# Altium project SwitchingRegulator.PrjPcb
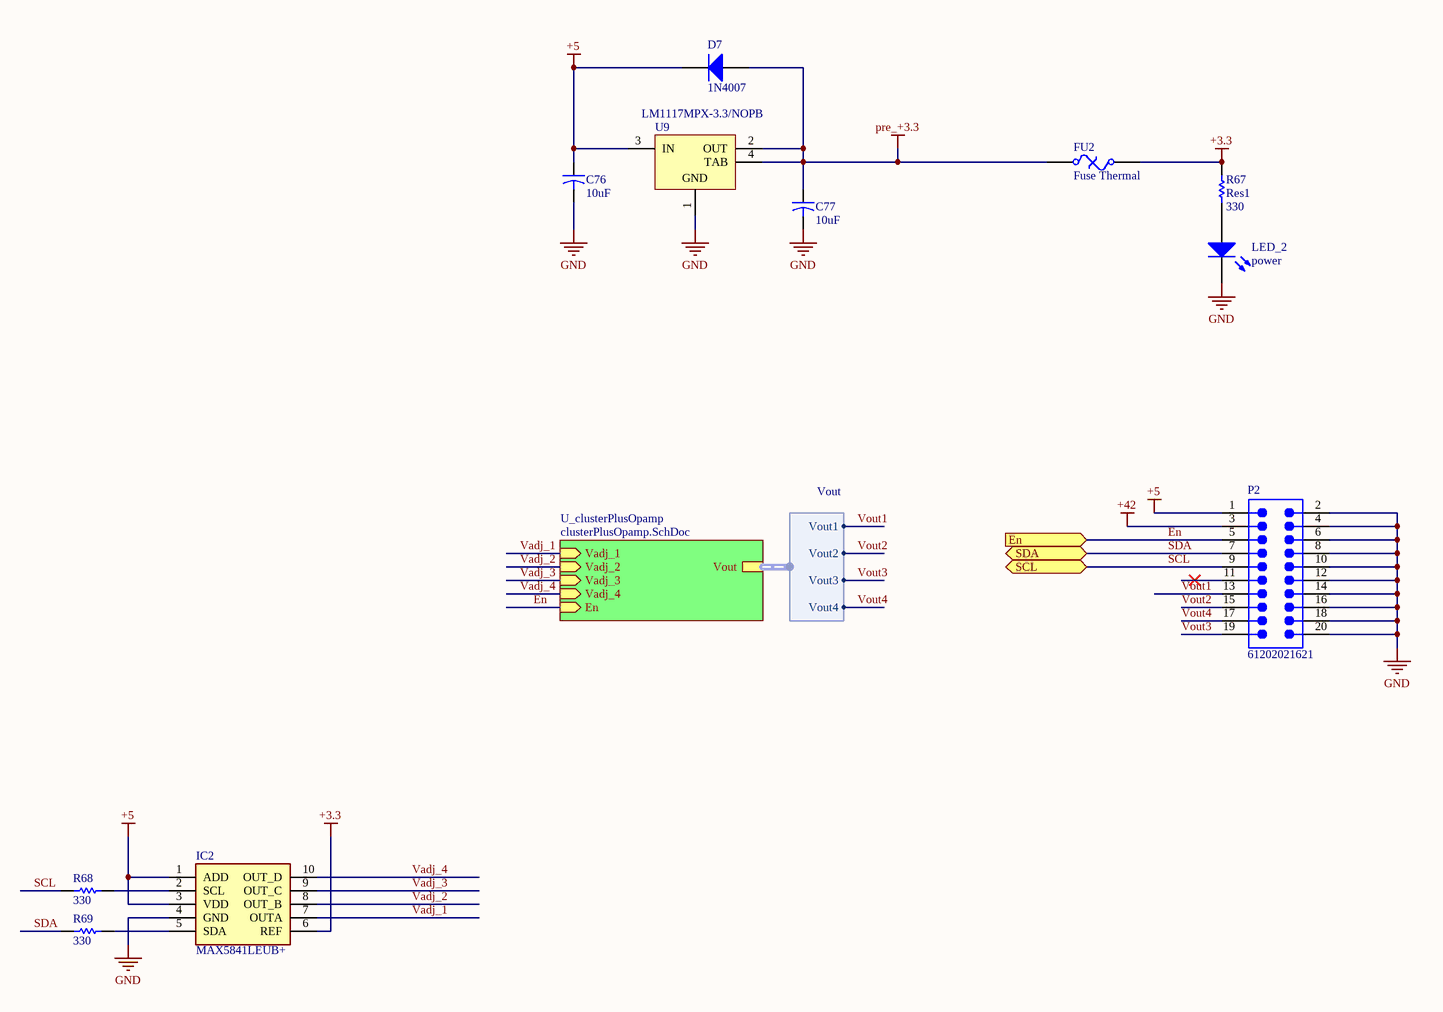
[diagram p0: AdjRegSection.SchDoc]
3 sheets, 134 parts. Net scope: hierarchical (ports join the sheet entries above them; power ports are global).
Board file: PCB1.PcbDoc
Sheets:
  AdjRegSection.SchDoc
    U_clusterPlusOpamp = clusterPlusOpamp.SchDoc
      SWReg1 = SWReg.SchDoc
      SWReg2 = SWReg.SchDoc
      SWReg3 = SWReg.SchDoc
      SWReg4 = SWReg.SchDoc

## Sheet AdjRegSection.SchDoc
size A3; SheetNumber: 1; SheetTotal: 3

### Parts
C76  value 10uF  [0805C]  (hidden comment: Cap_El)
C77  value 10uF  [0805C]  (hidden comment: Cap_El)
D7  1N4007  [430X270D]
FU2  Fuse Thermal  [1206]
IC2  MAX5841LEUB+  [SOP50P490X110-10N]
LED_2  power  [0805LED]
P2  61202021621  [61202021621]
R67  Res1  value 330  [0805L]
R68  330  [RESC3216X70X50NL05T20]
R69  330  [RESC3216X70X50NL05T20]
U9  LM1117MPX-3.3/NOPB  [DCY0004A_L]

### Sub-sheets
U_clusterPlusOpamp = clusterPlusOpamp.SchDoc: En (in), Vadj_1 (in), Vadj_2 (in), Vadj_3 (in), Vadj_4 (in), Vout (harness Vout)

### Ports
En (in), SCL (bidir), SDA (bidir)

### Harnesses
Vout: Vout1, Vout2, Vout3, Vout4

### Nets
+3.3: FU2.2 IC2.6(REF) R67.1
+5: C76.1 D7.2(K) IC2.1(ADD) IC2.3(VDD) P2.1 U9.3(IN)
+42: P2.3
GND: C76.2 C77.2 IC2.4(GND) LED_2.2(K) P2.2 P2.4 P2.6 P2.8 P2.10 P2.12 P2.14 P2.16 P2.18 P2.20 U9.1(GND)
pre_+3.3: C77.1 D7.1(A) FU2.1 U9.2(OUT) U9.4(TAB)
En: P2.5 ; port En, sheet U_clusterPlusOpamp/En
SCL: P2.9 R68.2 ; port SCL
SDA: P2.7 R69.2 ; port SDA
Vadj_1: IC2.7(OUTA) ; sheet U_clusterPlusOpamp/Vadj_1
Vadj_2: IC2.8(OUT_B) ; sheet U_clusterPlusOpamp/Vadj_2
Vadj_3: IC2.9(OUT_C) ; sheet U_clusterPlusOpamp/Vadj_3
Vadj_4: IC2.10(OUT_D) ; sheet U_clusterPlusOpamp/Vadj_4
Vout1: P2.13 ; sheet U_clusterPlusOpamp/Vout.Vout1
Vout2: P2.15 ; sheet U_clusterPlusOpamp/Vout.Vout2
Vout3: P2.19 ; sheet U_clusterPlusOpamp/Vout.Vout3
Vout4: P2.17 ; sheet U_clusterPlusOpamp/Vout.Vout4
NetIC2_2: IC2.2(SCL) R68.1
NetIC2_5: IC2.5(SDA) R69.1
NetLED_2_1: LED_2.1(A) R67.2

Not connected (* = marked no-connect by the designer): P2 11*

### Library data of the parts
C76 C77 = Cap_El: Capacitor; Published: 23-Sep-2002; PackageReference: CAPR5-4X5; Publisher: Altium Limited
D7 = Diode: 1 Amp General Purpose Rectifier; Revision 1: 11-Jul-2000: SIM Model Added.; Revision 2: 17-Jul-2002: Re-released for DXP Platform.; Package Information: Latest Revision: Aug-1999; Code - JEDEC: DO-204-AL; Published: 8-Jun-2000; Datasheet: Latest Revision: 1998; Package Reference: DO-41; Publisher: Altium Limited
FU2 = Fuse Thermal: Thermal Fuse; Published: 24-Mar-1999; LatestRevisionDate: 17-Jul-2002; LatestRevisionNote: Re-released for DXP Platform.; PackageReference: PIN-W2/E2.8; Publisher: Altium Limited; PackageDescription: Thru-Hole; 2 Leads
IC2 = MAX5841LEUB+: Integrated Circuit; Manufacturer_Name: Analog Devices; Datasheet Link: https://datasheets.maximintegrated.com/en/ds/MAX5841.pdf; Height: 1.1mm; Manufacturer_Part_Number: MAX5841LEUB+; Mouser Part Number: 700-MAX5841LEUB; Mouser Price/Stock: https://www.mouser.co.uk/ProductDetail/Maxim-Integrated/MAX5841LEUB%2b?qs=9Cj2FLRihcMjPr0cjsKN4w%3D%3D
LED_2 = LED3: Typical BLUE SiC LED; Published: 8-Jun-2000; LatestRevisionDate: 17-Dec-2003; LatestRevisionNote: PCB Footprint replaced.; DatasheetDocument: 16-Apr-2002; PackageDocument: 16-Apr-2002; PackageReference: 3.5X2.8X1.9; Publisher: Altium Limited
P2 = CMP-1502-00010-2: NexarPartId: 8917785; Number of Positions: 20; Row Spacing: 2.54mm; Voltage Rating (DC): 250V; Gender: Male; Insulation Resistance: 1GΩ; Current Rating: 3A; Connector Type: Male Pin; Contact Resistance: 20mΩ; Insulation: Insulated; Contact Material: Copper; REACH SVHC: Unknown; Width: 33.06mm; Pitch: 2.54mm; Housing Material: PBT; Number of Contacts: 20; Contact Plating: Gold; Mount: Through Hole; Termination: Through Hole; Number of Pins: 20; Color: Black; Max Operating Temperature: 105°C; Contact Gender: Male; Voltage Rating: 250V; Lead Pitch: 2.54mm; Operating Supply Voltage: 250V; Length: 33.06mm; Orientation: Vertical; Number of Rows: 2; Flammability Rating: UL94 V-0; RoHS: Compliant; Insulation Material: PBT; Min Operating Temperature: -40°C; Height: 8.85mm
R67 = Res1: Resistor; Published: 8-Jun-2000; LatestRevisionDate: 17-Jul-2002; LatestRevisionNote: Re-released for DXP Platform.; PackageReference: AXIAL-0.3; Publisher: Altium Limited
R68 R69 = CMP-2003-00782-1: Part Number: ERJ8BWFR068V; Manufacturer: Panasonic
U9 = CMP-0062-01639-4: 800mA Low-Dropout Linear Regulator, 4-pin SOT-223, Pb-Free; Manufacturer: Texas Instruments; High-Reliability: Y; PowerWise: N; PackageTopMarking: XYTT*N05A; CompType: LDO IC; ComponentLink1URL: http://www.ti.com/general/docs/lit/getliterature.tsp?genericPartNumber=LM1117-N&fileType=pdf; PartNumber: LM1117MPX-3.3/NOPB; ComponentLink1Description: Datasheet URL; PinCount: 4; Code_JEDEC: TO-261-AA; PackageDescription: Molded SOT-223, 6.50 x 3.56 x 1.6mm Body, 4 Lead, 2.3mm Pitch; PackageReference: DCY0004A; RoHS: Y; Code_IPC: SOT223-4

## Sheet clusterPlusOpamp.SchDoc
size A3; SheetNumber: 3; SheetTotal: 4
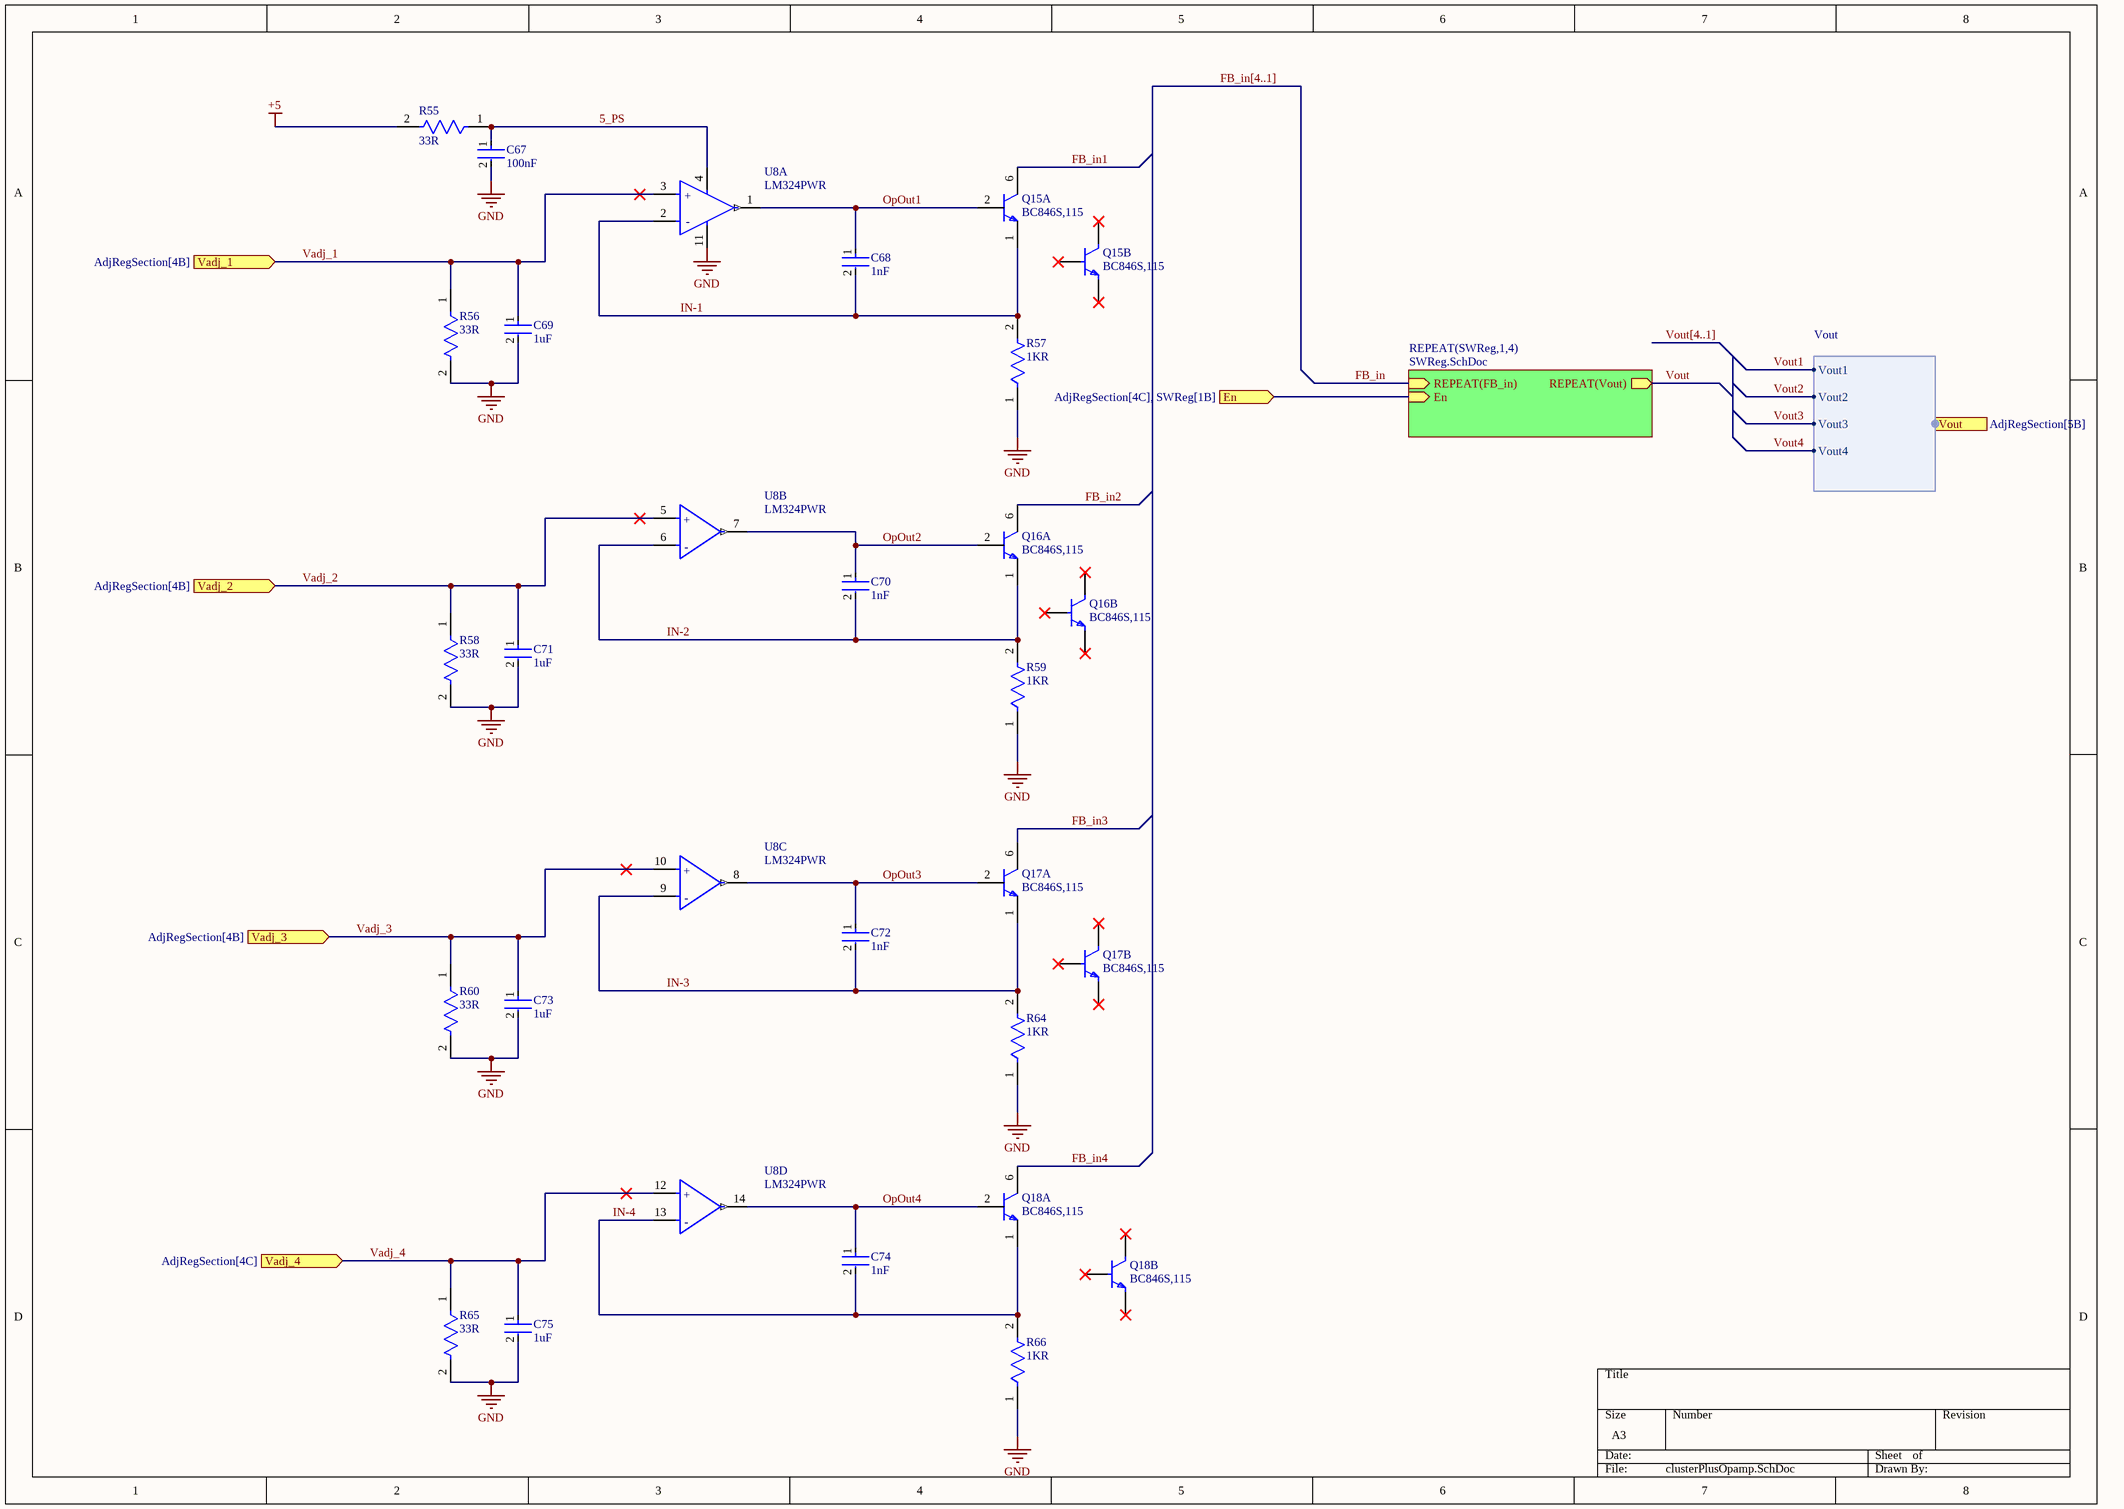
[diagram p1: clusterPlusOpamp.SchDoc]

### Parts
C67  100nF  [FP-CC1206-1_25-MFG]
C68  1nF  [FP-CC1206-1_25-MFG]
C69  1uF  [FP-CC1206-1_25-MFG]
C70  1nF  [FP-CC1206-1_25-MFG]
C71  1uF  [FP-CC1206-1_25-MFG]
C72  1nF  [FP-CC1206-1_25-MFG]
C73  1uF  [FP-CC1206-1_25-MFG]
C74  1nF  [FP-CC1206-1_25-MFG]
C75  1uF  [FP-CC1206-1_25-MFG]
Q15  BC846S,115  [FP-SOT363-MFG]  (parts A,B of 2)
Q16  BC846S,115  [FP-SOT363-MFG]  (parts A,B of 2)
Q17  BC846S,115  [FP-SOT363-MFG]  (parts A,B of 2)
Q18  BC846S,115  [FP-SOT363-MFG]  (parts A,B of 2)
R55  33R  [FP-RC0603-0_55-MFG]
R56  33R  [FP-RC0603-0_55-MFG]
R57  1KR  [FP-RC0603-0_55-MFG]
R58  33R  [FP-RC0603-0_55-MFG]
R59  1KR  [FP-RC0603-0_55-MFG]
R60  33R  [FP-RC0603-0_55-MFG]
R64  1KR  [FP-RC0603-0_55-MFG]
R65  33R  [FP-RC0603-0_55-MFG]
R66  1KR  [FP-RC0603-0_55-MFG]
U8  LM324PWR  [FP-PW0014A-MFG]  (parts A,B,C,D of 4)

### Sub-sheets
REPEAT(SWReg,1,4) = SWReg.SchDoc: REPEAT(Vout) (out), REPEAT(FB_in) (in), En (in)

### Ports
En (in, see AdjRegSection[4C], SWReg[1B]), Vadj_1 (in, see AdjRegSection[4B]), Vadj_2 (in, see AdjRegSection[4B]), Vadj_3 (in, see AdjRegSection[4B]), Vadj_4 (in, see AdjRegSection[4C]), Vout (harness Vout, see AdjRegSection[5B])

### Harnesses
Vout: Vout1, Vout2, Vout3, Vout4

### Nets
+5: R55.2
GND: C67.2 C69.2 C71.2 C73.2 C75.2 R56.2 R57.1 R58.2 R59.1 R60.2 R64.1 R65.2 R66.1 U8.11(GND)
5_PS: C67.1 R55.1 U8.4(VCC)
En: port En, sheet REPEAT(SWReg,1,4)/En
FB_in: sheet REPEAT(SWReg,1,4)/REPEAT(FB_in)
FB_in1: Q15.6(C)
FB_in2: Q16.6(C)
FB_in3: Q17.6(C)
FB_in4: Q18.6(C)
IN-1: C68.2 Q15.1(E) R57.2 U8.2(1IN-)
IN-2: C70.2 Q16.1(E) R59.2 U8.6(2IN-)
IN-3: C72.2 Q17.1(E) R64.2 U8.9(3IN-)
IN-4: C74.2 Q18.1(E) R66.2 U8.13(4IN-)
OpOut1: C68.1 Q15.2(B) U8.1(1OUT)
OpOut2: C70.1 Q16.2(B) U8.7(2OUT)
OpOut3: C72.1 Q17.2(B) U8.8(3OUT)
OpOut4: C74.1 Q18.2(B) U8.14(4OUT)
Vadj_1: C69.1 R56.1 U8.3(1IN+) ; port Vadj_1
Vadj_2: C71.1 R58.1 U8.5(2IN+) ; port Vadj_2
Vadj_3: C73.1 R60.1 U8.10(3IN+) ; port Vadj_3
Vadj_4: C75.1 R65.1 U8.12(4IN+) ; port Vadj_4
Vout: sheet REPEAT(SWReg,1,4)/REPEAT(Vout)

Not connected (* = marked no-connect by the designer): Q15 3(C)* 4(E)* 5(B)*; Q16 3(C)* 4(E)* 5(B)*; Q17 3(C)* 4(E)* 5(B)*; Q18 3(C)* 4(E)* 5(B)*

### Buses and harness runs
bus FB_in[4..1]
bus Vout[4..1]

### Notes on the sheet
- (in symbol CMP-04895-000037-1, part A) +; -
- (in symbol CMP-04895-000037-1, part B) +; -
- (in symbol CMP-04895-000037-1, part C) +; -
- (in symbol CMP-04895-000037-1, part D) +; -

### Library data of the parts
C67 = CMP-03422-000842-1: CAP CER 0.1UF 50V X7R 1206; Manufacturer: Yageo; Manufacturer Part Number: CC1206KRX7R9BB104; Automotive Grade: NA; Tolerance: 0.1; Material: Ceramic; Temperature Coefficient: 15%; Temperature Characteristic: X7R; Device Class L1: Passive Components; Lead Free: Yes; Octopart: https://octopart.com/cc1206krx7r9bb104-yageo-39467816; Category: Cap; Value: 100 nF; Temperature Range Low: -55°C; Device Class L3: Ceramic Capacitors; Voltage Rating: 50 V; Temperature Range High: +125°C; Device Class L2: Capacitors; RoHS: TRUE; Package: CC1206-1.25; Footprint Url: http://www.yageo.com/exep/pages/download/literatures/UPY-C_GEN_24.pdf; ComponentLink2Description: Datasheet; Temperature: -55°C to +125°C; Capacitance: 100 nF; Digikey Description: CAP CER 0.1UF 50V X7R 1206; Height: 1.45mm; Automotive: No; Mouser Description: Multilayer Ceramic Capacitors MLCC - SMD/SMT 100nF 50V X7R 10%; ComponentLink2URL: http://www.yageo.com/documents/recent/UPY-NP0X7R_HV_1KV-to-3KV_11.pdf
C68-C75 = CMP-03422-000842-1: CAP CER 0.1UF 50V X7R 1206; Manufacturer: Yageo; Manufacturer Part Number: CC1206KRX7R9BB104; Automotive Grade: NA; Value: 100 nF; Tolerance: 0.1; Material: Ceramic; Temperature Coefficient: 15%; Temperature Characteristic: X7R; Device Class L1: Passive Components; Lead Free: Yes; Octopart: https://octopart.com/cc1206krx7r9bb104-yageo-39467816; Category: Cap; Temperature Range Low: -55°C; Device Class L3: Ceramic Capacitors; Voltage Rating: 50 V; Temperature Range High: +125°C; Device Class L2: Capacitors; RoHS: TRUE; Package: CC1206-1.25; Footprint Url: http://www.yageo.com/exep/pages/download/literatures/UPY-C_GEN_24.pdf; ComponentLink2Description: Datasheet; Temperature: -55°C to +125°C; Capacitance: 100 nF; Digikey Description: CAP CER 0.1UF 50V X7R 1206; Height: 1.45mm; Automotive: No; Mouser Description: Multilayer Ceramic Capacitors MLCC - SMD/SMT 100nF 50V X7R 10%; ComponentLink2URL: http://www.yageo.com/documents/recent/UPY-NP0X7R_HV_1KV-to-3KV_11.pdf
Q15-Q18 = CMP-14406-000015-1: TRANS 2NPN 65V 0.1A 6TSSOP; Manufacturer: Nexperia; Collector Emitter Saturation Voltage: 300mV; Hfe Testvce: 5V; Max Collector Current: 100mA; Automotive Grade: Grade 0; Hfe Testic: 2mA; Hfe Min: 110; Collector Base Voltage: 80V; Max Junction Temp: +150°C; Rthja Max: 416K/W; Emitter Base Voltage: 6V; Number Of Elements: 2; Unity Gain Freq: 100MHz; Power Dissipation: 300mW; Device Class L2: Transistors; Lead Free: Yes; Height: 1.1mm; ComponentLink2URL: https://assets.nexperia.com/documents/data-sheet/BC846S.pdf; Temperature: to +150°C; Ambient Temperature Range Low: -65°C; Collector Emitter Voltage: 65V; Temperature Range High: +150°C; Category: Trans; Automotive: Yes; Octopart: https://octopart.com/bc846s%2C115-nexperia-78739099; Digikey Description: TRANS 2NPN 65V 0.1A 6TSSOP; Ambient Temperature Range High: +150°C; Footprint Url: https://assets.nexperia.com/documents/outline-drawing/SOT363.pdf; Device Class L3: BJTs; Device Class L1: Discrete Semiconductors; Package: SOT363; RoHS: TRUE; Manufacturer Part Number: BC846S,115; Number Of Npn: 2; ComponentLink2Description: Datasheet
R55-R60 R64-R66 = CMP-2100-03662-2: RES SMD 100K OHM 1% 1/10W 0603; Voltage Rating (DC): 50V; Resistance: 100kR; Max Power Dissipation: 100mW; Temperature Coefficient: 100ppm/°C; Working Voltage: 75V; Length: 1.6mm; Lead Free: Lead Free; Number of Terminations: 2; Packaging: Tape and Reel; Voltage Rating: 50V; Termination: SMD/SMT; Width: 0.8mm; Resistor Type: Thick Film; Resistance Tolerance: 1%; Features: Moisture Resistant; Height: 0.45mm; Construction: Rectangular; Case/Package: 0603; Military Standard: Not; Case Code (Imperial): 0603; Series: RC; Technology: THICK FILM; Depth: 0.8mm; RoHS Compliant: Yes; REACH SVHC: No SVHC; Min Operating Temperature: -55°C; Case Code (Metric): 1608; Max Operating Temperature: 155°C; Power Rating: 100mW; Number of Pins: 2; Tolerance: 1%
U8 = CMP-04895-000037-1: IC OPAMP GP 4 CIRCUIT 14TSSOP; Manufacturer: Texas Instruments; Voltage Gain: 100V/mV; Input Bias Current: -0.02uA; Output Current Per Channel: 20mA; Gain Bandwidth: 1.2MHz; Standoff Height: 0.05mm; Max Supply Voltage: 32V; Max Junction Temp: +150°C; Number Of Channels: 4; Input Offset Voltage: 3mV; Min Dual Supply Voltage: 1.5V; Min Supply Voltage: 3V; Max Dual Supply Voltage: 16V; Nominal Supply Current: 0.7-1.4mA; Temperature: 0°C to +70°C; Ambient Temperature Range Low: 0°C; Octopart: https://octopart.com/lm324pwr-texas+instruments-410375; Device Class L1: Integrated Circuits (ICs); Automotive: No; Package: PW0014A; Lead Free: Yes; Device Class L2: Linear ICs; Ambient Temperature Range High: +70°C; Device Class L3: Amplifiers - Op Amps; Height: 1.2mm; Temperature Range Low: 0°C; ComponentLink2Description: Datasheet; Category: IC; ComponentLink2URL: http://www.ti.com/lit/ds/symlink/lm324.pdf; Mouser Description: OP Amp Quad General Purpose ±16 Volt/32 Volt 14-Pin TSSOP; Digikey Description: IC OPAMP GP 4 CIRCUIT 14TSSOP; RoHS: TRUE; Temperature Range High: +70°C; Manufacturer Part Number: LM324PWR

## Sheet SWReg.SchDoc
size A3; SheetNumber: 4; SheetTotal: 4
Used 4 times, as channels U_clusterPlusOpamp/SWReg1, U_clusterPlusOpamp/SWReg2, U_clusterPlusOpamp/SWReg3, U_clusterPlusOpamp/SWReg4. Parts and nets are listed once, with the designators drawn on the sheet.
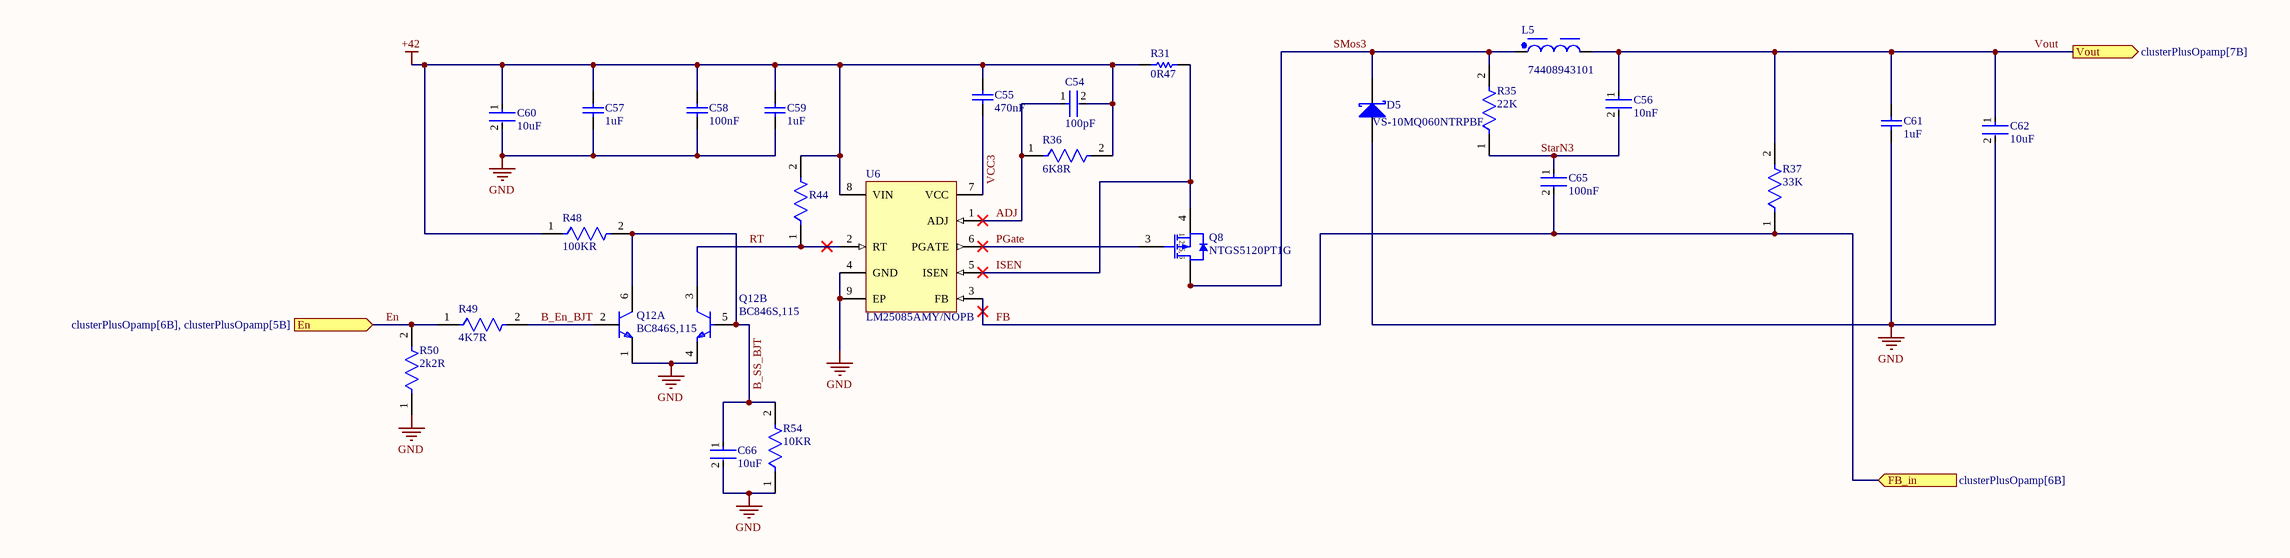
[diagram p2: SWReg.SchDoc]

### Parts
C54  100pF  [FP-C0402-BB-MFG]
C55  470nF  [CAPC1608X90X35LL15T15]
C56  10nF  [FP-CC1206-1_25-MFG]
C57  1uF  [CAPC1608X90X35LL15T15]
C58  100nF  [CAPC1608X90X35LL15T15]
C59  1uF  [CAPC1608X90X35LL15T15]
C60  10uF  [FP-CC1206-1_25-MFG]
C61  1uF  [CAPC2013X140X50LL20T25]
C62  10uF  [FP-GRM31C-0_2-e0_3_0_8-MFG]
C65  100nF  [FP-CC1206-1_25-MFG]
C66  10uF  [FP-CC1206-1_25-MFG]
D5  VS-10MQ060NTRPBF  [VISH-DO-214AC_V]
L5  74408943101  [WE-SPC_4838]
Q8  NTGS5120PT1G  [ONSC-TSOP-6-318G-02_V]
Q12  BC846S,115  [FP-SOT363-MFG]  (parts A,B of 2)
R31  0R47  [RESC3216X70X50NL05T20]
R35  22K  [FP-RC0402-0_4-MFG]
R36  6K8R  [FP-RC0402-0_4-MFG]
R37  33K  [FP-RC0603-0_55-MFG]
R44  240K  [FP-CRCW0603-e3-MFG]  (value not drawn)
R48  100KR  [FP-RC0402-0_4-MFG]
R49  4K7R  [FP-RC0402-0_4-MFG]
R50  2k2R  [FP-RC0402-0_4-MFG]
R54  10KR  [FP-RC0402-0_4-MFG]
U6  LM25085AMY/NOPB  [DGN0008A_M]

### Ports
En (in, see clusterPlusOpamp[6B], clusterPlusOpamp[5B]), FB_in (in, see clusterPlusOpamp[6B]), Vout (out, see clusterPlusOpamp[7B])

### Nets
+42: C54.2 C55.2 C57.2 C58.2 C59.2 C60.1 R31.1 R36.2 R44.2 R48.1 U6.8(VIN)
GND: C57.1 C58.1 C59.1 C60.2 C61.1 C62.2 C66.2 D5.1(A) Q12.1(E) Q12.4(E) R50.1 R54.1 U6.4(GND) U6.9(EP)
ADJ: C54.1 R36.1 U6.1(ADJ)
B_En_BJT: Q12.2(B) R49.2
B_SS_BJT: C66.1 Q12.5(B) Q12.6(C) R48.2 R54.2
En: R49.1 R50.2 ; port En
FB: C65.2 R37.1 U6.3(FB) ; port FB_in
ISEN: Q8.4(S) R31.2 U6.5(ISEN)
PGate: Q8.3(G) U6.6(PGATE)
RT: Q12.3(C) R44.1 U6.2(RT)
SMos3: D5.2(K) L5.1 Q8.1(D) Q8.2(D) Q8.5(D) Q8.6(D) R35.2
StarN3: C56.2 C65.1 R35.1
VCC3: C55.1 U6.7(VCC)
Vout: C56.1 C61.2 C62.1 L5.2 R37.2 ; port Vout

### Channels
U_clusterPlusOpamp/SWReg1: designators end in A; ports En=En FB_in=FB_in1 Vout=Vout1
U_clusterPlusOpamp/SWReg2: designators end in B; ports En=En FB_in=FB_in2 Vout=Vout2
U_clusterPlusOpamp/SWReg3: designators end in C; ports En=En FB_in=FB_in3 Vout=Vout3
U_clusterPlusOpamp/SWReg4: designators end in D; ports En=En FB_in=FB_in4 Vout=Vout4

### Notes on the sheet
- (in symbol CMP-1058-00979-1) 1, 2, 5, 6

### Library data of the parts
C54 = CMP-1034-00716-4: CAP CER 10PF 25V 5% NP0 0402; Manufacturer Part Number: C0402C100J3GACTU; Manufacturer: Kemet; Temperature Characteristic: C0G; Material: Ceramic; Temperature Coefficient: 15%; Tolerance: 0.05; Octopart: https://octopart.com/c0402c100j3gactu-kemet-9138549; Lead Free: Yes; Automotive: No; Value: 10 pF; Voltage Rating: 25 V; RoHS: TRUE; Device Class L2: Capacitors; Capacitance: 10 pF; Category: Cap; Temperature Range High: +125°C; ComponentLink2URL: https://content.kemet.com/datasheets/KEM_C1002_X7R_SMD.pdf; Temperature: -55°C to +125°C; Temperature Range Low: -55°C; Device Class L3: Ceramic Capacitors; Device Class L1: Passive Components; Mouser Description: Multilayer Ceramic Capacitors MLCC - SMD/SMT 25volts 10pF C0G 5%; ComponentLink2Description: Datasheet; Package: C0402-BB; Height: 0.55mm; Ipc Land Pattern Name: CAPC10050X50; Digikey Description: CAP CER 10PF 25V 5% NP0 0402
C55 C57-C59 = CMP-2006-02298-2: Manufacturer: Kemet; Part Number: C0603C105K4RACTU
C56 C60 C66 = CMP-03422-000842-1: as C68 on sheet clusterPlusOpamp; Temperature Characteristic: X7R; Device Class L1: Passive Components; Lead Free: Yes; Octopart: https://octopart.com/cc1206krx7r9bb104-yageo-39467816; Category: Cap; Temperature Range Low: -55°C; Device Class L3: Ceramic Capacitors; Voltage Rating: 50 V; Temperature Range High: +125°C; Device Class L2: Capacitors; RoHS: TRUE; Package: CC1206-1.25; Footprint Url: http://www.yageo.com/exep/pages/download/literatures/UPY-C_GEN_24.pdf; ComponentLink2Description: Datasheet; Temperature: -55°C to +125°C; Capacitance: 100 nF; Digikey Description: CAP CER 0.1UF 50V X7R 1206; Height: 1.45mm; Automotive: No; Mouser Description: Multilayer Ceramic Capacitors MLCC - SMD/SMT 100nF 50V X7R 10%; ComponentLink2URL: http://www.yageo.com/documents/recent/UPY-NP0X7R_HV_1KV-to-3KV_11.pdf
C61 = CMP-2007-03234-1: Part Number: C0805C105K3RACTU; Manufacturer: Kemet
C62 = CMP-06035-003589-1: Chip Multilayer Ceramic Capacitors for General Purpose, 1206, 10uF, X7R, 15%, 10%, 25V; Case Code (Imperial): 1206; Voltage Rating (DC): 25V; Voltage Rating: 25V; Length: 3.2mm; Lead Free: Lead Free; Thickness: 0.071inch; Package Quantity: 1; Width: 1.6mm; Max Operating Temperature: 125°C; Number of Pins: 2; Height: 1.6mm; Case Code (Metric): 3216; REACH SVHC: No SVHC; Radiation Hardening: No; Case/Package: 1206; Material: Ceramic; Tolerance: 10%; Voltage: 25V; Mount: Surface Mount; Packaging: Tape and Reel; Dielectric: X7R; Termination: SMD/SMT; Min Operating Temperature: -55°C; Capacitance: 10uF; Depth: 1.6mm
C65 = CMP-03422-000842-1: as C67 on sheet clusterPlusOpamp; Temperature Characteristic: X7R; Device Class L1: Passive Components; Lead Free: Yes; Octopart: https://octopart.com/cc1206krx7r9bb104-yageo-39467816; Category: Cap; Value: 100 nF; Temperature Range Low: -55°C; Device Class L3: Ceramic Capacitors; Voltage Rating: 50 V; Temperature Range High: +125°C; Device Class L2: Capacitors; RoHS: TRUE; Package: CC1206-1.25; Footprint Url: http://www.yageo.com/exep/pages/download/literatures/UPY-C_GEN_24.pdf; ComponentLink2Description: Datasheet; Temperature: -55°C to +125°C; Capacitance: 100 nF; Digikey Description: CAP CER 0.1UF 50V X7R 1206; Height: 1.45mm; Automotive: No; Mouser Description: Multilayer Ceramic Capacitors MLCC - SMD/SMT 100nF 50V X7R 10%; ComponentLink2URL: http://www.yageo.com/documents/recent/UPY-NP0X7R_HV_1KV-to-3KV_11.pdf
D5 = CMP-2000-07404-1: High Performance Schottky Rectifier, 60 V, 1 A, -55 to 150 degC, 2-Pin DO-214AC (SMA), RoHS, Tape and Reel; Manufacturer: Vishay; Current - Reverse Leakage @ Vr: 500µA@60V; Current - Average Rectified (Io): 2.1A; Speed: FastRecovery= / 200mA(Io); Voltage - Forward (Vf) (Max) @ If: 710mV@1.5A; Thermal Resistance: 80°C/WJa; Voltage - DC Reverse (Vr) (Max): 60V; Catalog Drawings: SMASeriesTop / SMASeriesSide; Other Names: 10MQ060NPBFTR / 10MQ060NTRPBF / VS-10MQ060NPBFTR / VS-10MQ060NPBFTR-ND / VS10MQ060NPBFTR-ND / VS10MQ060NTRPBF; Dynamic Catalog: SchottkyDiode; Mounting Type: SurfaceMount; Supplier Device Package: DO-214AC(SMA); Package / Case: DO-214AC,SMA; Mounting Technology: SurfaceMount; Datasheet URL: http://www.vishay.com/docs/94118/vs-10mq060npbf.pdf; Category: DiscreteSemiconductorProducts; Family: Diodes,Rectifiers-Single; Datasheet Version: 02/2015; Package Description: 2-Pin Surface Mount Device, Body 4.245 x 2.665 mm; Quantity Available: Tape&Reel(TR)AlternatePackaging; Junction Operating Temp: -55°C~150°C; Manufacturer URL: http://www.vishay.com/; Diode Type: Schottky; Package Reference: DO-214AC (SMA); Packaging: Tape&Reel(TR); Minimum Quantity: Schottky; Operating Temperature - Junction: -55°C~150°C; Standard Package: 7,500
L5 = CMP-1418-00004-2: NexarPartId: 22866605; Self Resonant Frequency: 7.8MHz; Current Rating: 520mA; Tolerance: 20%; Shielding: Shielded; Core Material: Ferrite; Test Frequency: 100kHz; Saturation Current: 680mA; Inductance: 100µH; DC Resistance (DCR): 770mΩ; Depth: 4.8mm; RMS Current (Irms): 520mA; Length: 4.8mm; REACH SVHC: Unknown; Height: 3.8mm; Height - Seated (Max): 4.0894mm; Min Operating Temperature: -40°C; Case/Package: Nonstandard; Composition: Wirewound; Width: 4.8mm; Packaging: Cut Tape (CT); Number of Pins: 2; Termination: SMD/SMT; RoHS: Compliant; Lead Free: Lead Free; Max DC Current: 520mA; Max Operating Temperature: 125°C; Inductance Tolerance: 20%; Ambient Temperature Range High: 85°C; Ambient Temperature Range Low: -40°C; Mount: Surface Mount
Q8 = CMP-1058-00979-1: Power MOSFET, -60 V, -2.9 A, Single P-Channel, 6-Pin TSOP, Pb-Free, Tape and Reel; Manufacturer: On Semiconductor; Channel Polarity: P Channel; ID Max (A): 2.9; VGS(th) Max (V): 3; VGS Max (V): 20; Ciss Typ (pF): 942; V(BR)DSS Min (V): 60; Qrr Typ (nC): 15.1; Coss Typ (pF): 72; Crss Typ (pF): 48; Packing: Tape and Reel; DatasheetVersion: Rev. P0; RoHS: Pb-Free; PackageDescription: 6-Pin Small Outline Package, Body 3 x 1.5 mm, Pitch 0.95 mm; Mounting Technology: Surface Mount; PackageVersion: Rev. V, 06/2012; Configuration: Single; ComponentLink1Description: Manufacturer URL; PartNumber: NTGS5120PT1G; PackageReference: TSOP-6-318G-02; ComponentLink2URL: http://www.onsemi.com/pub_link/Collateral/NTGS5120P-D.PDF; ComponentLink2Description: Datasheet; ComponentLink3URL: http://www.onsemi.com/pub_link/Collateral/318G-02.PDF; ComponentLink1URL: http://www.onsemi.com/; Package Type: TSOP-6; ComponentLink3Description: Package Specification
Q12 = CMP-14406-000015-1: as Q15 on sheet clusterPlusOpamp; Device Class L2: Transistors; Lead Free: Yes; Height: 1.1mm; ComponentLink2URL: https://assets.nexperia.com/documents/data-sheet/BC846S.pdf; Temperature: to +150°C; Ambient Temperature Range Low: -65°C; Collector Emitter Voltage: 65V; Temperature Range High: +150°C; Category: Trans; Automotive: Yes; Octopart: https://octopart.com/bc846s%2C115-nexperia-78739099; Digikey Description: TRANS 2NPN 65V 0.1A 6TSSOP; Ambient Temperature Range High: +150°C; Footprint Url: https://assets.nexperia.com/documents/outline-drawing/SOT363.pdf; Device Class L3: BJTs; Device Class L1: Discrete Semiconductors; Package: SOT363; RoHS: TRUE; Manufacturer Part Number: BC846S,115; Number Of Npn: 2; ComponentLink2Description: Datasheet
R31 = CMP-2003-00782-1: as R68 on sheet AdjRegSection
R35 R36 R48-R50 R54 = CMP-2002-08011-2: Tolerance: 5%; Power Rating: 63mW; Resistance: 4.7kΩ; Voltage Rating: 50V; Temperature Coefficient: 100ppm/°C; Composition: Thick Film; Max Operating Temperature: 155°C; Case/Package: 0402; Depth: 500µm; Packaging: Tape & Reel; Number of Pins: 2; Schedule B: 8533210045, 8533210045; Case Code (Imperial): 0402; Termination: SMD/SMT; Military Standard: Not; Lead Free: Lead Free; Width: 500µm; REACH SVHC: No SVHC; Max Power Dissipation: 63mW; Voltage Rating (AC): 50V; Features: Moisture Resistant; Min Operating Temperature: -55°C; Number of Terminations: 2; RoHS: Compliant; Height: 350µm; Voltage Rating (DC): 50V; Length: 1mm
R37 = CMP-2100-03662-2: as R55 on sheet clusterPlusOpamp; Length: 1.6mm; Lead Free: Lead Free; Number of Terminations: 2; Packaging: Tape and Reel; Voltage Rating: 50V; Termination: SMD/SMT; Width: 0.8mm; Resistor Type: Thick Film; Resistance Tolerance: 1%; Features: Moisture Resistant; Height: 0.45mm; Construction: Rectangular; Case/Package: 0603; Military Standard: Not; Case Code (Imperial): 0603; Series: RC; Technology: THICK FILM; Depth: 0.8mm; RoHS Compliant: Yes; REACH SVHC: No SVHC; Min Operating Temperature: -55°C; Case Code (Metric): 1608; Max Operating Temperature: 155°C; Power Rating: 100mW; Number of Pins: 2; Tolerance: 1%
R44 = CMP-1012-00717-3: RES Thick Film, 68kΩ, 1%, 0.1W, 100ppm/°C, 0603; Max Power Dissipation: 100mW; Resistance: 68kR; Voltage Rating (DC): 75V; Case Code (Metric): 1608; Termination: SMD/SMT; Tolerance: 1%; Case Code (Imperial): 0603; Radiation Hardening: No; Composition: Thick Film; Max Operating Temperature: 155°C; Features: Automotive AEC-Q200; Military Standard: Not; Contact Plating: Tin; Case/Package: 0603; Min Operating Temperature: -55°C; Power Rating: 100mW; Width: 0.033inch; Lead Free: Lead Free; Package Quantity: 10; Number of Terminations: 2; Mount: Surface Mount; Length: 1.55mm; Temperature Coefficient: 100ppm/°C; Packaging: Tape and Reel; Height: 0.45mm; Weight: 7.1E-05oz; Voltage Rating: 75V; Depth: 0.85mm; Number of Pins: 2
U6 = CMP-0063-01196-3: 42V Constant On-Time PFET Buck Switching Controller with 0.9V Reference, 8-pin eMSOP, Pb-Free; Manufacturer: Texas Instruments; CompType: MiscPower; PackageTopMarking: ZXTT*SVYA; PowerWise: N; PinCount: 8; ComponentLink1URL: http://www.ti.com/general/docs/lit/getliterature.tsp?genericPartNumber=LM25085A&fileType=pdf; RoHS: Y; Code_JEDEC: MO-187-AA; ComponentLink1Description: Datasheet URL; PackageDescription: Molded Mini-SO, Exposed Pad, .118 x .118 x .034in Body, 8 Lead, .0256in Pitch; PackageReference: DGN0008A

## Nets that join several sheets
+5: AdjRegSection (6 pins), clusterPlusOpamp (R55.2)
+42: AdjRegSection (P2.3), U_clusterPlusOpamp/SWReg1 (11 pins), U_clusterPlusOpamp/SWReg2 (11 pins), U_clusterPlusOpamp/SWReg3 (11 pins), U_clusterPlusOpamp/SWReg4 (11 pins)
GND: AdjRegSection (15 pins), clusterPlusOpamp (14 pins), U_clusterPlusOpamp/SWReg1 (14 pins), U_clusterPlusOpamp/SWReg2 (14 pins), U_clusterPlusOpamp/SWReg3 (14 pins), U_clusterPlusOpamp/SWReg4 (14 pins)
En: AdjRegSection (P2.5), U_clusterPlusOpamp/SWReg1 (R49A.1 R50A.2), U_clusterPlusOpamp/SWReg2 (R49B.1 R50B.2), U_clusterPlusOpamp/SWReg3 (R49C.1 R50C.2), U_clusterPlusOpamp/SWReg4 (R49D.1 R50D.2)
FB_in1: clusterPlusOpamp (Q15.6), U_clusterPlusOpamp/SWReg1 (C65A.2 R37A.1 U6A.3)
FB_in2: clusterPlusOpamp (Q16.6), U_clusterPlusOpamp/SWReg2 (C65B.2 R37B.1 U6B.3)
FB_in3: clusterPlusOpamp (Q17.6), U_clusterPlusOpamp/SWReg3 (C65C.2 R37C.1 U6C.3)
FB_in4: clusterPlusOpamp (Q18.6), U_clusterPlusOpamp/SWReg4 (C65D.2 R37D.1 U6D.3)
Vadj_1: AdjRegSection (IC2.7), clusterPlusOpamp (C69.1 R56.1 U8.3)
Vadj_2: AdjRegSection (IC2.8), clusterPlusOpamp (C71.1 R58.1 U8.5)
Vadj_3: AdjRegSection (IC2.9), clusterPlusOpamp (C73.1 R60.1 U8.10)
Vadj_4: AdjRegSection (IC2.10), clusterPlusOpamp (C75.1 R65.1 U8.12)
Vout1: AdjRegSection (P2.13), U_clusterPlusOpamp/SWReg1 (5 pins)
Vout2: AdjRegSection (P2.15), U_clusterPlusOpamp/SWReg2 (5 pins)
Vout3: AdjRegSection (P2.19), U_clusterPlusOpamp/SWReg3 (5 pins)
Vout4: AdjRegSection (P2.17), U_clusterPlusOpamp/SWReg4 (5 pins)